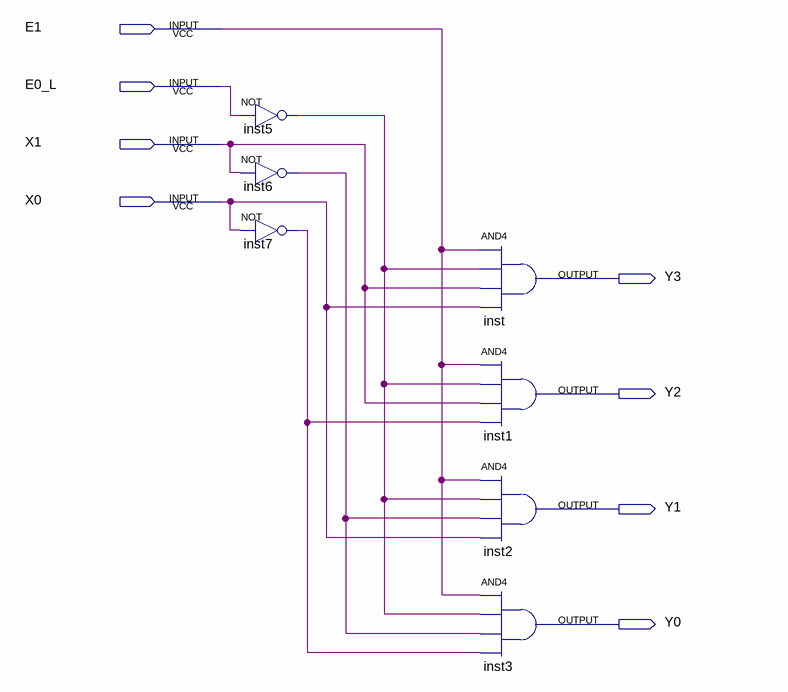
[diagram p0: schematic sheet]
// Quartus schematic Dec2_4.bdf as structural Verilog: 7 symbols, 8 pins
module Dec2_4 (
  input  E1,
  input  E0_L,
  input  X1,
  input  X0,
  output Y3,
  output Y2,
  output Y1,
  output Y0
);

  wire inst5_out, inst6_out, inst7_out;

  not inst5 (inst5_out, E0_L);
  not inst6 (inst6_out, X1);
  not inst7 (inst7_out, X0);
  and inst (Y3, E1, inst5_out, X1, X0);
  and inst1 (Y2, E1, inst5_out, X1, inst7_out);
  and inst2 (Y1, E1, inst5_out, inst6_out, X0);
  and inst3 (Y0, E1, inst5_out, inst6_out, inst7_out);
endmodule
